# Altium schematic sheet uart.SchDoc: UART & I2C
size A3; Author: Olexandr Gudozhnik; Organization: EPFL-STI-LIS; Address1: EPFL, Station 9; Address2: 1015, Lausanne; Address3: Switzerland; DocumentNumber: 4; SheetNumber: 4; SheetTotal: 8
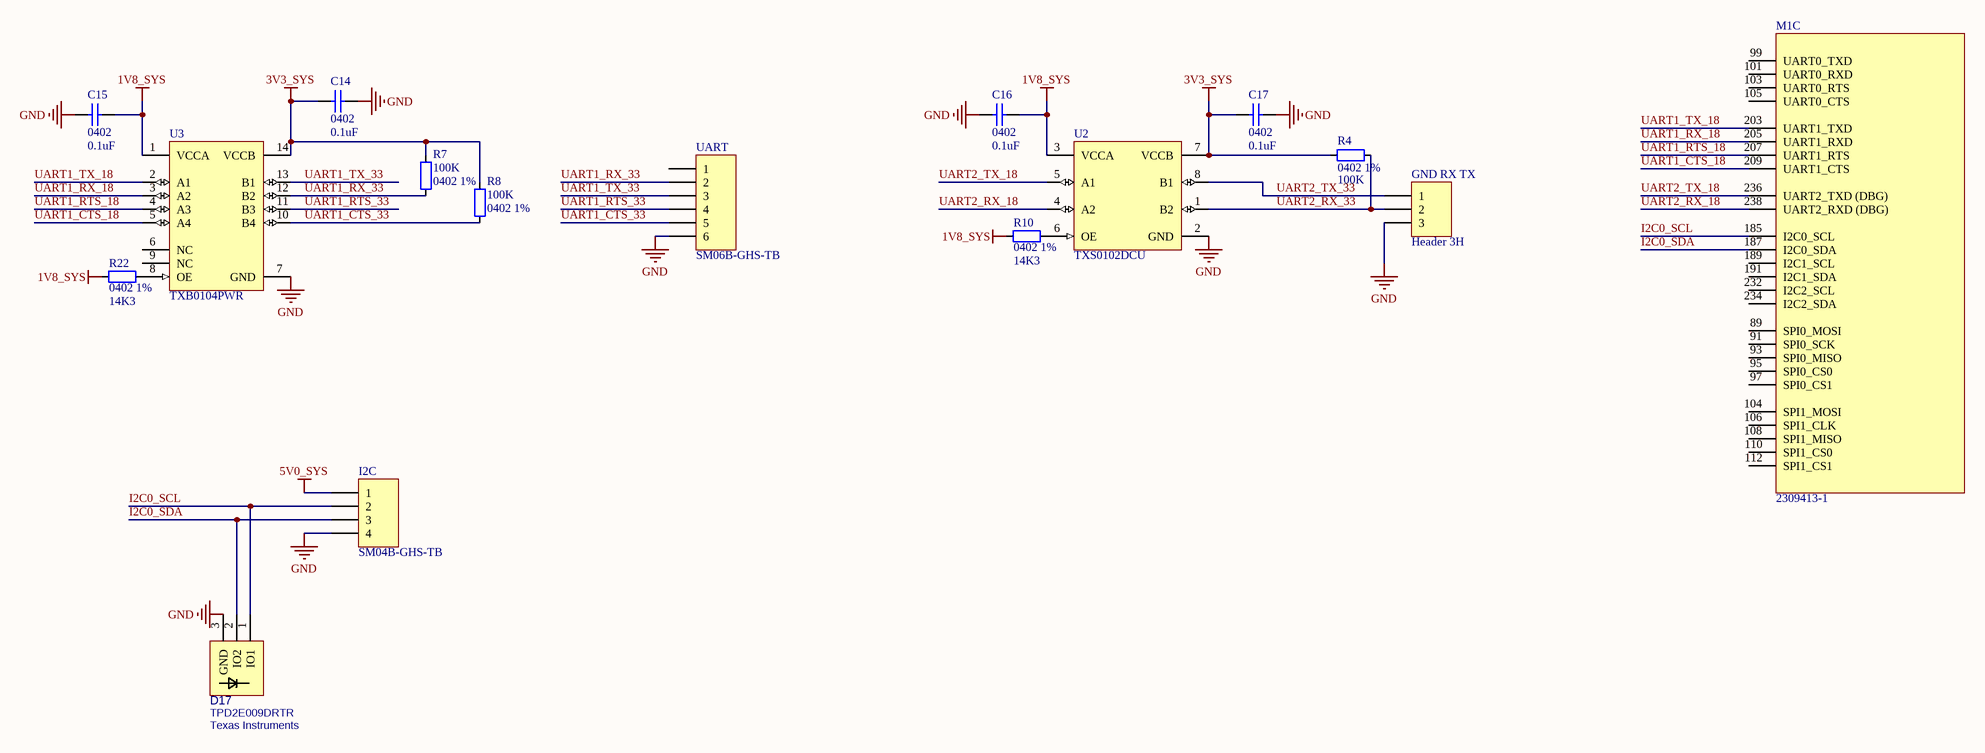
[diagram p0: uart.SchDoc]

## Parts
C14  0402  value 0.1uF  [cap0402]
C15  0402  value 0.1uF  [cap0402]
C16  0402  value 0.1uF  [cap0402]
C17  0402  value 0.1uF  [cap0402]
D17  TPD2E009DRTR  Manufacturer: Texas Instruments  [SOT-3]
GND_RX_TX  Header 3H  [header_vert_2.54_3pin]
I2C  SM04B-GHS-TB  [JST_GH_4_side]
M1  2309413-1  [jetson-nano-connector]  (part C of 7)
R4  0402 1%  value 100K  [res0402]
R7  0402 1%  value 100K  [res0402]
R8  0402 1%  value 100K  [res0402]
R10  0402 1%  value 14K3  [res0402]
R22  0402 1%  value 14K3  [res0402]
U2  TXS0102DCU  [TSOP8_065pitch]
U3  TXB0104PWR  [PW0014A_L]
UART  SM06B-GHS-TB  [JST_GH_6_side]

## Nets
1V8_SYS: C15.1 C16.1 R10.2 R22.2 U2.3(VCCA) U3.1(VCCA)
3V3_SYS: C14.2 C17.2 R4.2 R7.2 R8.2 U2.7(VCCB) U3.14(VCCB)
5V0_SYS: I2C.1
GND: C14.1 C15.2 C16.2 C17.1 D17.3(GND) GND_RX_TX.3 I2C.4 U2.2(GND) U3.7(GND) UART.6
I2C0_SCL: D17.1(IO1) I2C.2 M1.185(I2C0_SCL)
I2C0_SDA: D17.2(IO2) I2C.3 M1.187(I2C0_SDA)
UART1_CTS_18: M1.209(UART1_CTS) U3.5(A4)
UART1_CTS_33: R8.1 U3.10(B4) UART.5
UART1_RTS_18: M1.207(UART1_RTS) U3.4(A3)
UART1_RTS_33: U3.11(B3) UART.4
UART1_RX_18: M1.205(UART1_RXD) U3.3(A2)
UART1_RX_33: R7.1 U3.12(B2) UART.2
UART1_TX_18: M1.203(UART1_TXD) U3.2(A1)
UART1_TX_33: U3.13(B1) UART.3
UART2_RX_18: M1.238(UART2_RXD_(DBG)) U2.4(A2)
UART2_RX_33: GND_RX_TX.2 R4.1 U2.1(B2)
UART2_TX_18: M1.236(UART2_TXD_(DBG)) U2.5(A1)
UART2_TX_33: GND_RX_TX.1 U2.8(B1)
NetR10_1: R10.1 U2.6(OE)
NetR22_1: R22.1 U3.8(OE)

Not connected (* = marked no-connect by the designer): M1 89(SPI0_MOSI) 91(SPI0_SCK) 93(SPI0_MISO) 95(SPI0_CS0) 97(SPI0_CS1) 99(UART0_TXD) 101(UART0_RXD) 103(UART0_RTS) 104(SPI1_MOSI) 105(UART0_CTS) 106(SPI1_CLK) 108(SPI1_MISO) 110(SPI1_CS0) 112(SPI1_CS1) 189(I2C1_SCL) 191(I2C1_SDA) 232(I2C2_SCL) 234(I2C2_SDA); U3 6(NC) 9(NC); UART 1

## Notes on the sheet
- Author:
- Title
- Size:
- Date:
- A4
- Number:
- Sheet
- Revision:
- of
- File:

## Library data of the parts
C14-C17 = cap: standard, non-polarized capacitor; Supplier 1: Digi-Key; Supplier Part Number 1: 490-14603-1-ND; Supplier Price 1: 0.08; Footprint verified: no
D17 = TPD2E009: ESD Suppressors 2-CH; PartNumber: TPD2E009DRTR; Value: TPD2E009DRTR; PartSymbol: TPD2E009DRTR; Supplier 1: Digi-Key; Supplier Part Number 1: 296-25410-1-ND
GND_RX_TX = Header 3H: Header, 3-Pin, Right Angle; LatestRevisionDate: 17-Jul-2002; LatestRevisionNote: Re-released for DXP Platform.; Publisher: Altium Limited
I2C = Header 4: Header, 4-Pin; LatestRevisionDate: 17-Jul-2002; LatestRevisionNote: Re-released for DXP Platform.; Publisher: Altium Limited; Supplier 1: Digi-Key; Supplier Part Number 1: 455-1566-1-ND
M1 = 2309413-1: Memory Socket, DDR4, SODIMM Socket, 260 Contacts, Copper Alloy, Gold Plated Contacts; Manufacturer: TE CONNECTIVITY; PartNumber: 2309413-1; Value: 2309413-1; PartSymbol: 2309413-1
R4 R7 R8 = res: 100K; Supplier 1: Digi-Key; Supplier Part Number 1: P100KLCT-ND
R10 R22 = res: Supplier 1: Digi-Key; Supplier Part Number 1: P14.3KLCT-ND
U2 = TXS0102DCU: Bidirectional voltage level translator; Supplier 1: Digi-Key; Supplier Part Number 1: 296-32603-1-ND
U3 = TXB0104PWR: Bidir. voltage level translator; Supplier 1: Digi-Key; Supplier Part Number 1: 296-21929-1-ND
UART = Header 6: Header, 6-Pin; LatestRevisionDate: 17-Jul-2002; LatestRevisionNote: Re-released for DXP Platform.; Publisher: Altium Limited; Supplier 1: Digi-Key; Supplier Part Number 1: 455-1568-1-ND